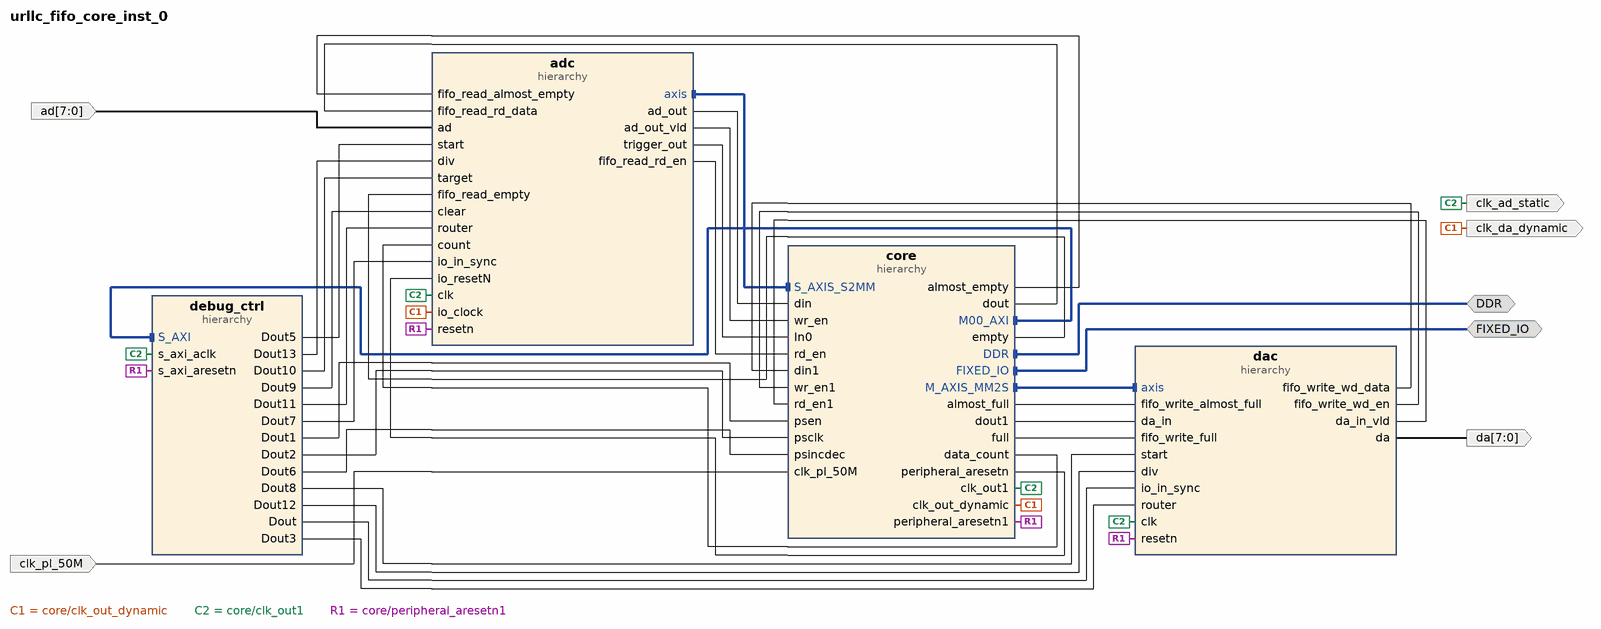
[diagram p0: block diagram of the top level]
# Vivado block design urllc_fifo_core_inst_0, xc7z020clg400-2, Vivado 2021.1
create_bd_design urllc_fifo_core_inst_0

create_bd_intf_port -mode Master -vlnv xilinx.com:interface:ddrx_rtl:1.0 DDR
create_bd_intf_port -mode Master -vlnv xilinx.com:display_processing_system7:fixedio_rtl:1.0 FIXED_IO
create_bd_port -dir I -from 7 -to 0 ad
create_bd_port -dir O -type clk clk_ad_static
create_bd_port -dir O -from 7 -to 0 da
create_bd_port -dir O -type clk clk_da_dynamic
create_bd_port -dir I -type clk clk_pl_50M

create_bd_cell -type hier adc
create_bd_cell -type hier core
create_bd_cell -type hier dac
create_bd_cell -type hier debug_ctrl

# ---- hierarchy /adc ----
current_bd_instance /adc
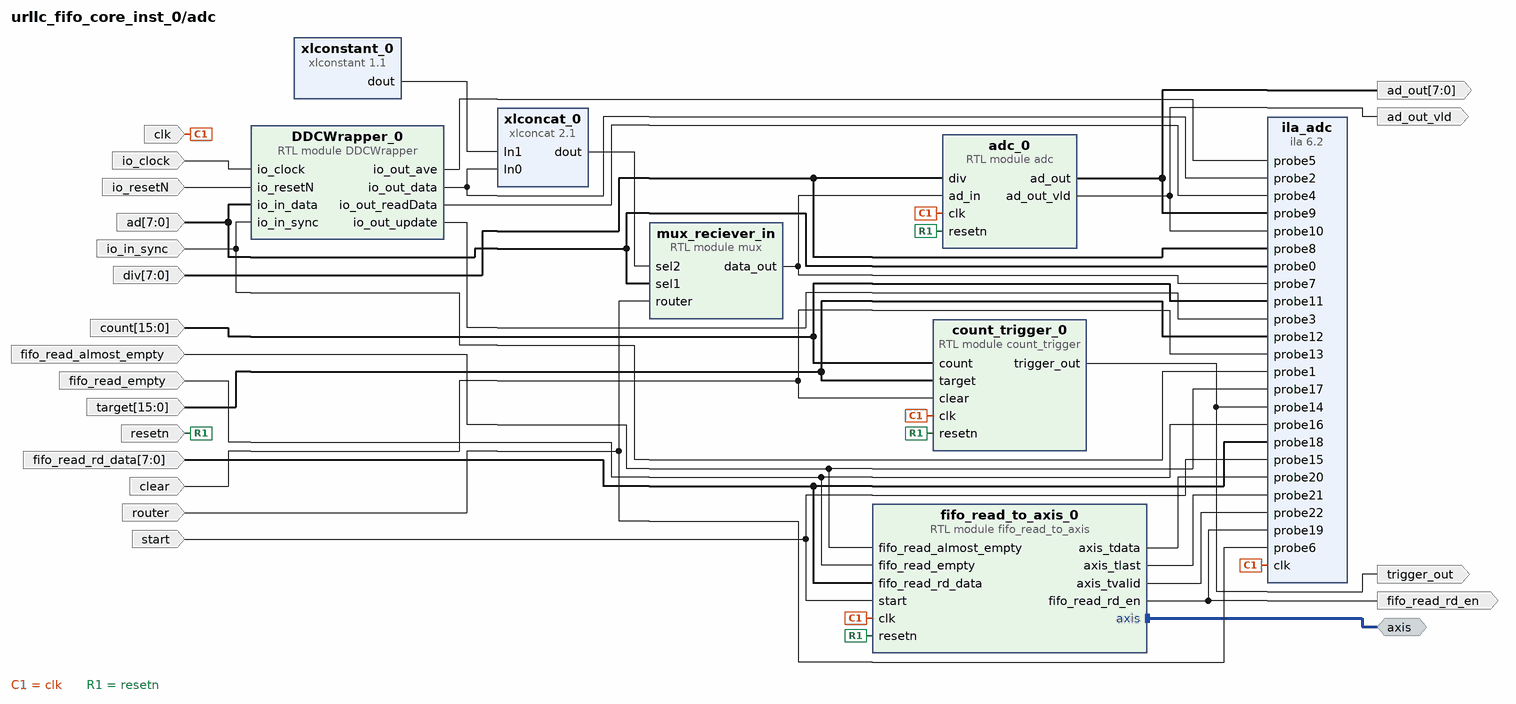
[diagram p1: block diagram inside /adc]
create_bd_intf_pin -mode Master -vlnv xilinx.com:interface:axis_rtl:1.0 axis
create_bd_pin -dir I -from 7 -to 0 ad
create_bd_pin -dir I io_in_sync
create_bd_pin -dir I -type clk clk
create_bd_pin -dir I -type rst resetn
create_bd_pin -dir O -from 7 -to 0 ad_out
create_bd_pin -dir O ad_out_vld
create_bd_pin -dir I router
create_bd_pin -dir I -from 15 -to 0 count
create_bd_pin -dir I -from 15 -to 0 target
create_bd_pin -dir I clear
create_bd_pin -dir O trigger_out
create_bd_pin -dir I fifo_read_almost_empty
create_bd_pin -dir I fifo_read_empty
create_bd_pin -dir O fifo_read_rd_en
create_bd_pin -dir I -from 7 -to 0 fifo_read_rd_data
create_bd_pin -dir I start
create_bd_pin -dir I -type clk io_clock
create_bd_pin -dir I -type rst io_resetN
create_bd_pin -dir I -from 7 -to 0 div

create_bd_cell -type module -reference DDCWrapper DDCWrapper_0
create_bd_cell -type module -reference mux mux_reciever_in
create_bd_cell -type module -reference count_trigger count_trigger_0
create_bd_cell -type module -reference fifo_read_to_axis fifo_read_to_axis_0
create_bd_cell -type module -reference adc adc_0
create_bd_cell -type ip -vlnv xilinx.com:ip:xlconcat:2.1 xlconcat_0
set_property -dict {CONFIG.dout_width 8} [get_bd_cells xlconcat_0]
create_bd_cell -type ip -vlnv xilinx.com:ip:xlconstant:1.1 xlconstant_0
set_property -dict {CONFIG.CONST_VAL 0 CONFIG.CONST_WIDTH 7} [get_bd_cells xlconstant_0]
create_bd_cell -type ip -vlnv xilinx.com:ip:ila:6.2 ila_adc
set_property -dict [list \
  CONFIG.C_DATA_DEPTH 8192 \
  CONFIG.C_ENABLE_ILA_AXI_MON false \
  CONFIG.C_MONITOR_TYPE Native \
  CONFIG.C_NUM_OF_PROBES 23 \
] [get_bd_cells ila_adc]

# ---- hierarchy /core ----
current_bd_instance /core
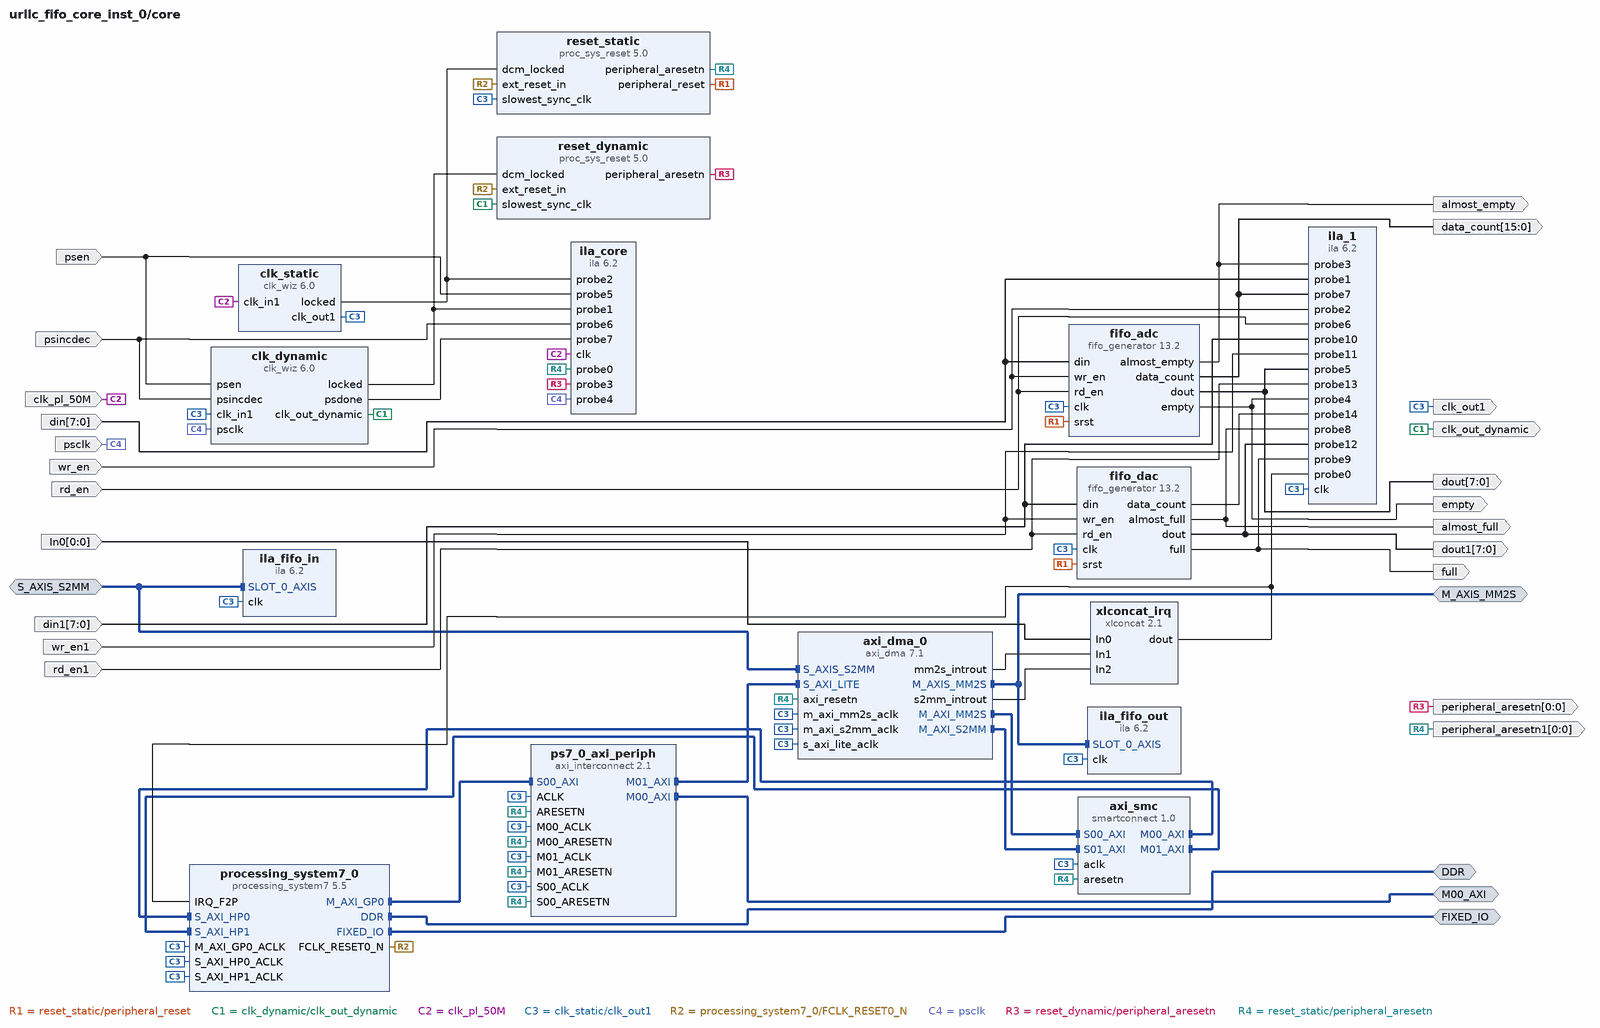
[diagram p2: block diagram inside /core]
create_bd_intf_pin -mode Master -vlnv xilinx.com:interface:ddrx_rtl:1.0 DDR
create_bd_intf_pin -mode Master -vlnv xilinx.com:display_processing_system7:fixedio_rtl:1.0 FIXED_IO
create_bd_intf_pin -mode Master -vlnv xilinx.com:interface:axis_rtl:1.0 M_AXIS_MM2S
create_bd_intf_pin -mode Slave -vlnv xilinx.com:interface:axis_rtl:1.0 S_AXIS_S2MM
create_bd_intf_pin -mode Master -vlnv xilinx.com:interface:aximm_rtl:1.0 M00_AXI
create_bd_pin -dir O -from 0 -to 0 -type rst peripheral_aresetn
create_bd_pin -dir I -from 7 -to 0 din
create_bd_pin -dir I wr_en
create_bd_pin -dir I rd_en
create_bd_pin -dir O -from 7 -to 0 dout
create_bd_pin -dir O empty
create_bd_pin -dir O almost_empty
create_bd_pin -dir O -from 15 -to 0 data_count
create_bd_pin -dir I -from 7 -to 0 din1
create_bd_pin -dir I wr_en1
create_bd_pin -dir I rd_en1
create_bd_pin -dir O -from 7 -to 0 dout1
create_bd_pin -dir O full
create_bd_pin -dir O almost_full
create_bd_pin -dir O -type clk clk_out_dynamic
create_bd_pin -dir O -type clk clk_out1
create_bd_pin -dir I psincdec
create_bd_pin -dir I psen
create_bd_pin -dir I psclk
create_bd_pin -dir O -from 0 -to 0 -type rst peripheral_aresetn1
create_bd_pin -dir I -from 0 -to 0 In0
create_bd_pin -dir I clk_pl_50M

create_bd_cell -type ip -vlnv xilinx.com:ip:processing_system7:5.5 processing_system7_0
set_property -dict [list \
  CONFIG.PCW_APU_PERIPHERAL_FREQMHZ 666.666666 \
  CONFIG.PCW_CPU_CPU_6X4X_MAX_RANGE 767 \
  CONFIG.PCW_ENET0_ENET0_IO {MIO 16 .. 27} \
  CONFIG.PCW_ENET0_GRP_MDIO_ENABLE 1 \
  CONFIG.PCW_ENET0_GRP_MDIO_IO EMIO \
  CONFIG.PCW_ENET0_PERIPHERAL_ENABLE 1 \
  CONFIG.PCW_FPGA0_PERIPHERAL_FREQMHZ 50 \
  CONFIG.PCW_FPGA1_PERIPHERAL_FREQMHZ 50 \
  CONFIG.PCW_GPIO_MIO_GPIO_ENABLE 0 \
  CONFIG.PCW_IRQ_F2P_INTR 1 \
  CONFIG.PCW_PERIPHERAL_BOARD_PRESET None \
  CONFIG.PCW_PRESET_BANK1_VOLTAGE {LVCMOS 1.8V} \
  CONFIG.PCW_QSPI_GRP_SINGLE_SS_ENABLE 1 \
  CONFIG.PCW_QSPI_GRP_SINGLE_SS_IO {MIO 1 .. 6} \
  CONFIG.PCW_QSPI_PERIPHERAL_ENABLE 1 \
  CONFIG.PCW_QSPI_QSPI_IO {MIO 1 .. 6} \
  CONFIG.PCW_SD0_GRP_CD_ENABLE 0 \
  CONFIG.PCW_SD0_GRP_WP_ENABLE 0 \
  CONFIG.PCW_SD0_PERIPHERAL_ENABLE 1 \
  CONFIG.PCW_SD0_SD0_IO {MIO 40 .. 45} \
  CONFIG.PCW_SDIO_PERIPHERAL_FREQMHZ 100 \
  CONFIG.PCW_SINGLE_QSPI_DATA_MODE x4 \
  CONFIG.PCW_UART1_PERIPHERAL_ENABLE 1 \
  CONFIG.PCW_UART1_UART1_IO {MIO 48 .. 49} \
  CONFIG.PCW_UART_PERIPHERAL_FREQMHZ 100 \
  CONFIG.PCW_UIPARAM_DDR_BUS_WIDTH {16 Bit} \
  CONFIG.PCW_UIPARAM_DDR_FREQ_MHZ 533.333333 \
  CONFIG.PCW_UIPARAM_DDR_PARTNO {MT41J256M16 RE-125} \
  CONFIG.PCW_USB0_PERIPHERAL_ENABLE 0 \
  CONFIG.PCW_USE_FABRIC_INTERRUPT 1 \
  CONFIG.PCW_USE_S_AXI_HP0 1 \
  CONFIG.PCW_USE_S_AXI_HP1 1 \
] [get_bd_cells processing_system7_0]
# 423 more settings of processing_system7_0 are not shown: defaults, MIO pin electricals, DDR timing, and values the tool derives
create_bd_cell -type ip -vlnv xilinx.com:ip:proc_sys_reset:5.0 reset_dynamic
create_bd_cell -type ip -vlnv xilinx.com:ip:axi_dma:7.1 axi_dma_0
set_property -dict [list \
  CONFIG.c_include_sg 0 \
  CONFIG.c_m_axis_mm2s_tdata_width 8 \
  CONFIG.c_mm2s_burst_size 256 \
  CONFIG.c_s2mm_burst_size 256 \
] [get_bd_cells axi_dma_0]
create_bd_cell -type ip -vlnv xilinx.com:ip:smartconnect:1.0 axi_smc
set_property -dict {CONFIG.NUM_MI 2 CONFIG.NUM_SI 2} [get_bd_cells axi_smc]
create_bd_cell -type ip -vlnv xilinx.com:ip:clk_wiz:6.0 clk_dynamic
set_property -dict [list \
  CONFIG.CLKIN1_JITTER_PS 166.66 \
  CONFIG.CLKOUT1_JITTER 163.829 \
  CONFIG.CLKOUT1_PHASE_ERROR 130.371 \
  CONFIG.CLKOUT1_REQUESTED_OUT_FREQ 60 \
  CONFIG.CLK_OUT1_PORT clk_out_dynamic \
  CONFIG.MMCM_CLKFBOUT_MULT_F 17.000 \
  CONFIG.MMCM_CLKIN1_PERIOD 16.667 \
  CONFIG.MMCM_CLKIN2_PERIOD 10.0 \
  CONFIG.MMCM_CLKOUT0_DIVIDE_F 17.000 \
  CONFIG.MMCM_DIVCLK_DIVIDE 1 \
  CONFIG.PRIM_IN_FREQ 60.000 \
  CONFIG.PRIM_SOURCE Global_buffer \
  CONFIG.RESET_PORT reset \
  CONFIG.RESET_TYPE ACTIVE_HIGH \
  CONFIG.USE_DYN_PHASE_SHIFT true \
  CONFIG.USE_RESET false \
] [get_bd_cells clk_dynamic]
create_bd_cell -type ip -vlnv xilinx.com:ip:fifo_generator:13.2 fifo_adc
set_property -dict [list \
  CONFIG.Almost_Empty_Flag true \
  CONFIG.Almost_Full_Flag true \
  CONFIG.Data_Count true \
  CONFIG.Data_Count_Width 16 \
  CONFIG.FIFO_Implementation_rach Common_Clock_Distributed_RAM \
  CONFIG.FIFO_Implementation_wach Common_Clock_Distributed_RAM \
  CONFIG.FIFO_Implementation_wrch Common_Clock_Distributed_RAM \
  CONFIG.INTERFACE_TYPE Native \
  CONFIG.Input_Data_Width 8 \
  CONFIG.Input_Depth 65536 \
  CONFIG.Output_Data_Width 8 \
  CONFIG.Reset_Type Synchronous_Reset \
] [get_bd_cells fifo_adc]
create_bd_cell -type ip -vlnv xilinx.com:ip:fifo_generator:13.2 fifo_dac
set_property -dict [list \
  CONFIG.Almost_Empty_Flag true \
  CONFIG.Almost_Full_Flag true \
  CONFIG.Data_Count true \
  CONFIG.Data_Count_Width 16 \
  CONFIG.Input_Data_Width 8 \
  CONFIG.Input_Depth 65536 \
  CONFIG.Output_Data_Width 8 \
] [get_bd_cells fifo_dac]
create_bd_cell -type ip -vlnv xilinx.com:ip:axi_interconnect:2.1 ps7_0_axi_periph
set_property -dict {CONFIG.NUM_MI 2} [get_bd_cells ps7_0_axi_periph]
create_bd_cell -type ip -vlnv xilinx.com:ip:xlconcat:2.1 xlconcat_irq
set_property -dict {CONFIG.NUM_PORTS 3 CONFIG.dout_width 3} [get_bd_cells xlconcat_irq]
create_bd_cell -type ip -vlnv xilinx.com:ip:proc_sys_reset:5.0 reset_static
create_bd_cell -type ip -vlnv xilinx.com:ip:ila:6.2 ila_core
set_property -dict [list \
  CONFIG.C_DATA_DEPTH 8192 \
  CONFIG.C_ENABLE_ILA_AXI_MON false \
  CONFIG.C_MONITOR_TYPE Native \
  CONFIG.C_NUM_OF_PROBES 8 \
] [get_bd_cells ila_core]
create_bd_cell -type ip -vlnv xilinx.com:ip:clk_wiz:6.0 clk_static
set_property -dict [list \
  CONFIG.CLKIN1_JITTER_PS 200.0 \
  CONFIG.CLKOUT1_JITTER 180.523 \
  CONFIG.CLKOUT1_PHASE_ERROR 162.874 \
  CONFIG.CLKOUT1_REQUESTED_OUT_FREQ 60.000 \
  CONFIG.MMCM_CLKFBOUT_MULT_F 20.250 \
  CONFIG.MMCM_CLKIN1_PERIOD 20.000 \
  CONFIG.MMCM_CLKIN2_PERIOD 10.0 \
  CONFIG.MMCM_CLKOUT0_DIVIDE_F 16.875 \
  CONFIG.MMCM_DIVCLK_DIVIDE 1 \
  CONFIG.PRIM_SOURCE Single_ended_clock_capable_pin \
  CONFIG.RESET_PORT reset \
  CONFIG.RESET_TYPE ACTIVE_HIGH \
  CONFIG.USE_RESET false \
] [get_bd_cells clk_static]
create_bd_cell -type ip -vlnv xilinx.com:ip:ila:6.2 ila_1
set_property -dict [list \
  CONFIG.C_DATA_DEPTH 8192 \
  CONFIG.C_ENABLE_ILA_AXI_MON false \
  CONFIG.C_MONITOR_TYPE Native \
  CONFIG.C_NUM_OF_PROBES 15 \
  CONFIG.C_PROBE0_WIDTH 3 \
] [get_bd_cells ila_1]
create_bd_cell -type ip -vlnv xilinx.com:ip:ila:6.2 ila_fifo_in
set_property -dict [list \
  CONFIG.C_ENABLE_ILA_AXI_MON true \
  CONFIG.C_MONITOR_TYPE AXI \
  CONFIG.C_NUM_OF_PROBES 9 \
  CONFIG.C_SLOT_0_AXI_PROTOCOL AXI4S \
] [get_bd_cells ila_fifo_in]
create_bd_cell -type ip -vlnv xilinx.com:ip:ila:6.2 ila_fifo_out
set_property -dict [list \
  CONFIG.C_ENABLE_ILA_AXI_MON true \
  CONFIG.C_MONITOR_TYPE AXI \
  CONFIG.C_NUM_OF_PROBES 9 \
  CONFIG.C_SLOT_0_AXI_PROTOCOL AXI4S \
] [get_bd_cells ila_fifo_out]

# ---- hierarchy /dac ----
current_bd_instance /dac
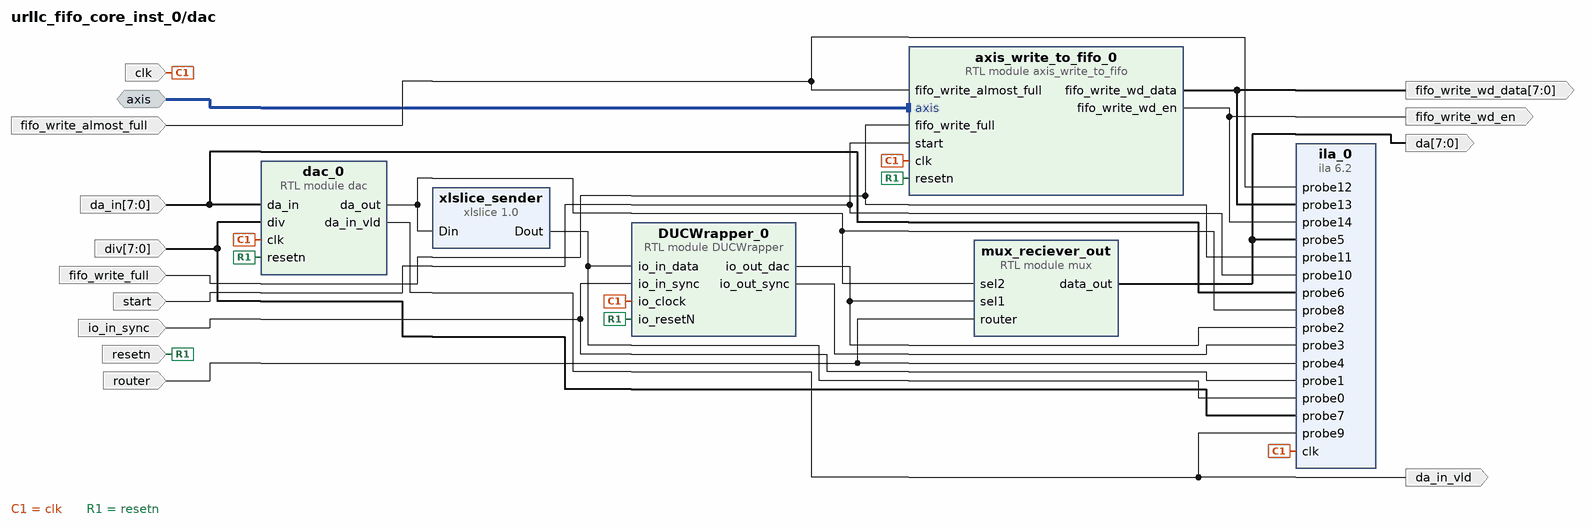
[diagram p3: block diagram inside /dac]
create_bd_intf_pin -mode Slave -vlnv xilinx.com:interface:axis_rtl:1.0 axis
create_bd_pin -dir O -from 7 -to 0 da
create_bd_pin -dir I router
create_bd_pin -dir I io_in_sync
create_bd_pin -dir I -type clk clk
create_bd_pin -dir I -type rst resetn
create_bd_pin -dir I start
create_bd_pin -dir I fifo_write_full
create_bd_pin -dir I fifo_write_almost_full
create_bd_pin -dir O -from 7 -to 0 fifo_write_wd_data
create_bd_pin -dir O fifo_write_wd_en
create_bd_pin -dir I -from 7 -to 0 da_in
create_bd_pin -dir I -from 7 -to 0 div
create_bd_pin -dir O da_in_vld

create_bd_cell -type module -reference mux mux_reciever_out
create_bd_cell -type module -reference axis_write_to_fifo axis_write_to_fifo_0
create_bd_cell -type module -reference dac dac_0
create_bd_cell -type module -reference DUCWrapper DUCWrapper_0
create_bd_cell -type ip -vlnv xilinx.com:ip:xlslice:1.0 xlslice_sender
set_property -dict {CONFIG.DIN_FROM 0 CONFIG.DIN_TO 0 CONFIG.DIN_WIDTH 8} [get_bd_cells xlslice_sender]
create_bd_cell -type ip -vlnv xilinx.com:ip:ila:6.2 ila_0
set_property -dict [list \
  CONFIG.C_DATA_DEPTH 8192 \
  CONFIG.C_ENABLE_ILA_AXI_MON false \
  CONFIG.C_MONITOR_TYPE Native \
  CONFIG.C_NUM_OF_PROBES 15 \
] [get_bd_cells ila_0]

# ---- hierarchy /debug_ctrl ----
current_bd_instance /debug_ctrl
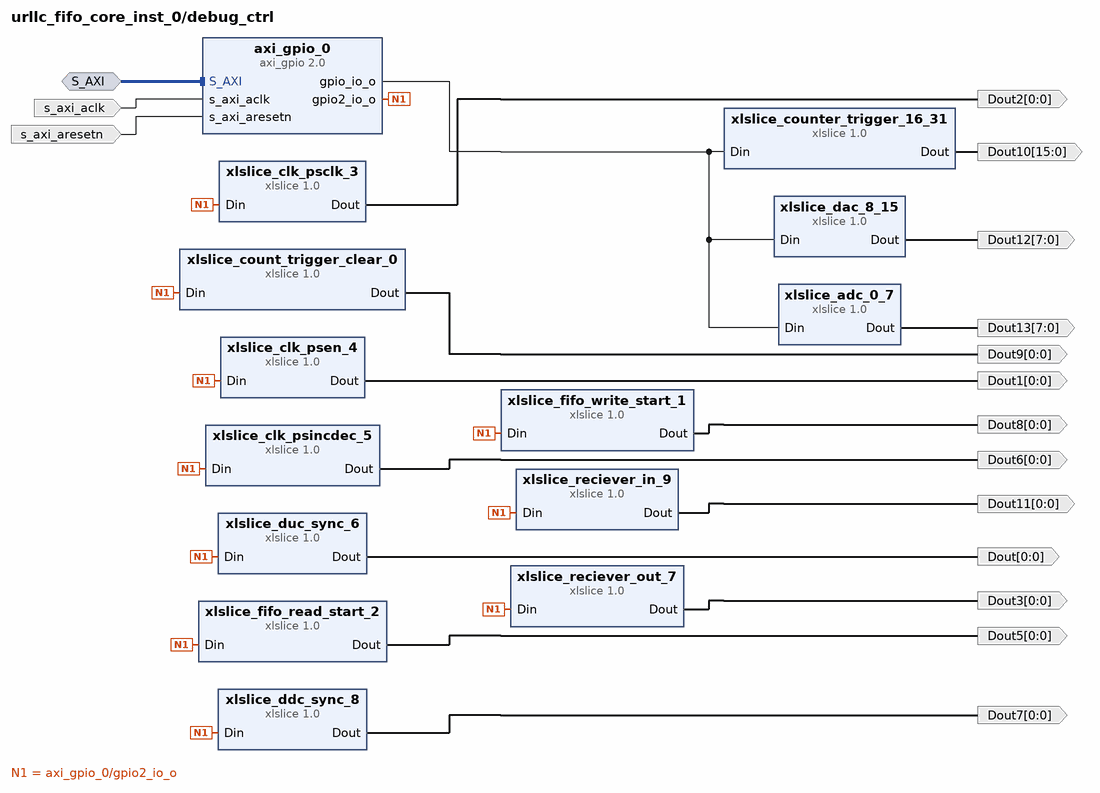
[diagram p4: block diagram inside /debug_ctrl]
create_bd_intf_pin -mode Slave -vlnv xilinx.com:interface:aximm_rtl:1.0 S_AXI
create_bd_pin -dir O -from 0 -to 0 Dout
create_bd_pin -dir O -from 0 -to 0 Dout1
create_bd_pin -dir O -from 0 -to 0 Dout2
create_bd_pin -dir O -from 0 -to 0 Dout3
create_bd_pin -dir O -from 0 -to 0 Dout5
create_bd_pin -dir I -type clk s_axi_aclk
create_bd_pin -dir I -type rst s_axi_aresetn
create_bd_pin -dir O -from 0 -to 0 Dout6
create_bd_pin -dir O -from 0 -to 0 Dout7
create_bd_pin -dir O -from 0 -to 0 Dout8
create_bd_pin -dir O -from 0 -to 0 Dout9
create_bd_pin -dir O -from 15 -to 0 Dout10
create_bd_pin -dir O -from 0 -to 0 Dout11
create_bd_pin -dir O -from 7 -to 0 Dout12
create_bd_pin -dir O -from 7 -to 0 Dout13

create_bd_cell -type ip -vlnv xilinx.com:ip:axi_gpio:2.0 axi_gpio_0
set_property -dict {CONFIG.C_ALL_OUTPUTS 1 CONFIG.C_ALL_OUTPUTS_2 1 CONFIG.C_IS_DUAL 1} [get_bd_cells axi_gpio_0]
create_bd_cell -type ip -vlnv xilinx.com:ip:xlslice:1.0 xlslice_fifo_write_start_1
set_property -dict {CONFIG.DIN_FROM 1 CONFIG.DIN_TO 1 CONFIG.DOUT_WIDTH 1} [get_bd_cells xlslice_fifo_write_start_1]
create_bd_cell -type ip -vlnv xilinx.com:ip:xlslice:1.0 xlslice_counter_trigger_16_31
set_property -dict {CONFIG.DIN_FROM 31 CONFIG.DIN_TO 16 CONFIG.DOUT_WIDTH 16} [get_bd_cells xlslice_counter_trigger_16_31]
create_bd_cell -type ip -vlnv xilinx.com:ip:xlslice:1.0 xlslice_count_trigger_clear_0
set_property -dict {CONFIG.DIN_FROM 0 CONFIG.DIN_TO 0 CONFIG.DOUT_WIDTH 1} [get_bd_cells xlslice_count_trigger_clear_0]
create_bd_cell -type ip -vlnv xilinx.com:ip:xlslice:1.0 xlslice_dac_8_15
set_property -dict {CONFIG.DIN_FROM 15 CONFIG.DIN_TO 8 CONFIG.DOUT_WIDTH 8} [get_bd_cells xlslice_dac_8_15]
create_bd_cell -type ip -vlnv xilinx.com:ip:xlslice:1.0 xlslice_clk_psen_4
set_property -dict {CONFIG.DIN_FROM 4 CONFIG.DIN_TO 4 CONFIG.DOUT_WIDTH 1} [get_bd_cells xlslice_clk_psen_4]
create_bd_cell -type ip -vlnv xilinx.com:ip:xlslice:1.0 xlslice_clk_psincdec_5
set_property -dict {CONFIG.DIN_FROM 5 CONFIG.DIN_TO 5 CONFIG.DOUT_WIDTH 1} [get_bd_cells xlslice_clk_psincdec_5]
create_bd_cell -type ip -vlnv xilinx.com:ip:xlslice:1.0 xlslice_clk_psclk_3
set_property -dict {CONFIG.DIN_FROM 3 CONFIG.DIN_TO 3 CONFIG.DOUT_WIDTH 1} [get_bd_cells xlslice_clk_psclk_3]
create_bd_cell -type ip -vlnv xilinx.com:ip:xlslice:1.0 xlslice_duc_sync_6
set_property -dict {CONFIG.DIN_FROM 6 CONFIG.DIN_TO 6 CONFIG.DOUT_WIDTH 1} [get_bd_cells xlslice_duc_sync_6]
create_bd_cell -type ip -vlnv xilinx.com:ip:xlslice:1.0 xlslice_reciever_in_9
set_property -dict {CONFIG.DIN_FROM 9 CONFIG.DIN_TO 9 CONFIG.DOUT_WIDTH 1} [get_bd_cells xlslice_reciever_in_9]
create_bd_cell -type ip -vlnv xilinx.com:ip:xlslice:1.0 xlslice_reciever_out_7
set_property -dict {CONFIG.DIN_FROM 7 CONFIG.DIN_TO 7 CONFIG.DOUT_WIDTH 1} [get_bd_cells xlslice_reciever_out_7]
create_bd_cell -type ip -vlnv xilinx.com:ip:xlslice:1.0 xlslice_fifo_read_start_2
set_property -dict {CONFIG.DIN_FROM 1 CONFIG.DIN_TO 1 CONFIG.DOUT_WIDTH 1} [get_bd_cells xlslice_fifo_read_start_2]
create_bd_cell -type ip -vlnv xilinx.com:ip:xlslice:1.0 xlslice_ddc_sync_8
set_property -dict {CONFIG.DIN_FROM 8 CONFIG.DIN_TO 8 CONFIG.DOUT_WIDTH 1} [get_bd_cells xlslice_ddc_sync_8]
create_bd_cell -type ip -vlnv xilinx.com:ip:xlslice:1.0 xlslice_adc_0_7
set_property -dict {CONFIG.DIN_FROM 7 CONFIG.DOUT_WIDTH 8} [get_bd_cells xlslice_adc_0_7]

# ---- connections ----

current_bd_instance /adc
connect_bd_intf_net [get_bd_intf_pins axis] [get_bd_intf_pins fifo_read_to_axis_0/axis]
connect_bd_net [get_bd_pins DDCWrapper_0/io_out_ave] [get_bd_pins ila_adc/probe5]
connect_bd_net [get_bd_pins DDCWrapper_0/io_out_data] [get_bd_pins xlconcat_0/In0] [get_bd_pins ila_adc/probe2]
connect_bd_net [get_bd_pins DDCWrapper_0/io_out_readData] [get_bd_pins ila_adc/probe4]
connect_bd_net [get_bd_pins DDCWrapper_0/io_out_update] [get_bd_pins ila_adc/probe3]
connect_bd_net [get_bd_pins clk] \
  [get_bd_pins fifo_read_to_axis_0/clk] [get_bd_pins count_trigger_0/clk] [get_bd_pins adc_0/clk] [get_bd_pins ila_adc/clk]
connect_bd_net [get_bd_pins resetn] [get_bd_pins fifo_read_to_axis_0/resetn] [get_bd_pins count_trigger_0/resetn] [get_bd_pins adc_0/resetn]
connect_bd_net [get_bd_pins io_clock] [get_bd_pins DDCWrapper_0/io_clock]
connect_bd_net [get_bd_pins io_resetN] [get_bd_pins DDCWrapper_0/io_resetN]
connect_bd_net [get_bd_pins ad] [get_bd_pins mux_reciever_in/sel1] [get_bd_pins DDCWrapper_0/io_in_data] [get_bd_pins ila_adc/probe0]
connect_bd_net [get_bd_pins adc_0/ad_out] [get_bd_pins ad_out] [get_bd_pins ila_adc/probe9]
connect_bd_net [get_bd_pins adc_0/ad_out_vld] [get_bd_pins ad_out_vld] [get_bd_pins ila_adc/probe10]
connect_bd_net [get_bd_pins count_trigger_0/trigger_out] [get_bd_pins trigger_out] [get_bd_pins ila_adc/probe14]
connect_bd_net [get_bd_pins div] [get_bd_pins adc_0/div] [get_bd_pins ila_adc/probe8]
connect_bd_net -net fifo_adc_data_count [get_bd_pins count] [get_bd_pins count_trigger_0/count] [get_bd_pins ila_adc/probe11]
connect_bd_net [get_bd_pins fifo_read_almost_empty] [get_bd_pins fifo_read_to_axis_0/fifo_read_almost_empty] [get_bd_pins ila_adc/probe17]
connect_bd_net [get_bd_pins fifo_read_empty] [get_bd_pins fifo_read_to_axis_0/fifo_read_empty] [get_bd_pins ila_adc/probe16]
connect_bd_net [get_bd_pins fifo_read_rd_data] [get_bd_pins fifo_read_to_axis_0/fifo_read_rd_data] [get_bd_pins ila_adc/probe18]
connect_bd_net [get_bd_pins fifo_read_to_axis_0/axis_tdata] [get_bd_pins ila_adc/probe20]
connect_bd_net [get_bd_pins fifo_read_to_axis_0/axis_tlast] [get_bd_pins ila_adc/probe21]
connect_bd_net [get_bd_pins fifo_read_to_axis_0/axis_tvalid] [get_bd_pins ila_adc/probe22]
connect_bd_net [get_bd_pins fifo_read_to_axis_0/fifo_read_rd_en] [get_bd_pins fifo_read_rd_en] [get_bd_pins ila_adc/probe19]
connect_bd_net [get_bd_pins io_in_sync] [get_bd_pins DDCWrapper_0/io_in_sync] [get_bd_pins ila_adc/probe1]
connect_bd_net [get_bd_pins mux_reciever_in/data_out] [get_bd_pins adc_0/ad_in] [get_bd_pins ila_adc/probe7]
connect_bd_net [get_bd_pins start] [get_bd_pins fifo_read_to_axis_0/start] [get_bd_pins ila_adc/probe15]
connect_bd_net [get_bd_pins xlconcat_0/dout] [get_bd_pins mux_reciever_in/sel2]
connect_bd_net [get_bd_pins xlconstant_0/dout] [get_bd_pins xlconcat_0/In1]
connect_bd_net -net xlslice_1_Dout [get_bd_pins target] [get_bd_pins count_trigger_0/target] [get_bd_pins ila_adc/probe12]
connect_bd_net -net xlslice_2_Dout [get_bd_pins clear] [get_bd_pins count_trigger_0/clear] [get_bd_pins ila_adc/probe13]
connect_bd_net -net xlslice_reciever_in_10_Dout [get_bd_pins router] [get_bd_pins mux_reciever_in/router] [get_bd_pins ila_adc/probe6]

current_bd_instance /core
connect_bd_intf_net [get_bd_intf_pins M_AXIS_MM2S] [get_bd_intf_pins axi_dma_0/M_AXIS_MM2S]
connect_bd_intf_net [get_bd_intf_pins M_AXIS_MM2S] [get_bd_intf_pins ila_fifo_out/SLOT_0_AXIS]
connect_bd_intf_net [get_bd_intf_pins axi_dma_0/M_AXI_MM2S] [get_bd_intf_pins axi_smc/S00_AXI]
connect_bd_intf_net [get_bd_intf_pins axi_dma_0/M_AXI_S2MM] [get_bd_intf_pins axi_smc/S01_AXI]
connect_bd_intf_net [get_bd_intf_pins axi_smc/M00_AXI] [get_bd_intf_pins processing_system7_0/S_AXI_HP0]
connect_bd_intf_net [get_bd_intf_pins axi_smc/M01_AXI] [get_bd_intf_pins processing_system7_0/S_AXI_HP1]
connect_bd_intf_net [get_bd_intf_pins S_AXIS_S2MM] [get_bd_intf_pins axi_dma_0/S_AXIS_S2MM]
connect_bd_intf_net [get_bd_intf_pins S_AXIS_S2MM] [get_bd_intf_pins ila_fifo_in/SLOT_0_AXIS]
connect_bd_intf_net [get_bd_intf_pins DDR] [get_bd_intf_pins processing_system7_0/DDR]
connect_bd_intf_net [get_bd_intf_pins FIXED_IO] [get_bd_intf_pins processing_system7_0/FIXED_IO]
connect_bd_intf_net [get_bd_intf_pins processing_system7_0/M_AXI_GP0] [get_bd_intf_pins ps7_0_axi_periph/S00_AXI]
connect_bd_intf_net [get_bd_intf_pins M00_AXI] [get_bd_intf_pins ps7_0_axi_periph/M00_AXI]
connect_bd_intf_net [get_bd_intf_pins ps7_0_axi_periph/M01_AXI] [get_bd_intf_pins axi_dma_0/S_AXI_LITE]
connect_bd_net -net In0_1 [get_bd_pins In0] [get_bd_pins xlconcat_irq/In0]
connect_bd_net [get_bd_pins reset_static/peripheral_reset] [get_bd_pins fifo_adc/srst] [get_bd_pins fifo_dac/srst]
connect_bd_net -net adc_0_ad_out [get_bd_pins din] [get_bd_pins fifo_adc/din] [get_bd_pins ila_1/probe1]
connect_bd_net -net adc_0_ad_out_vld [get_bd_pins wr_en] [get_bd_pins fifo_adc/wr_en] [get_bd_pins ila_1/probe2]
connect_bd_net [get_bd_pins axi_dma_0/mm2s_introut] [get_bd_pins xlconcat_irq/In1]
connect_bd_net [get_bd_pins axi_dma_0/s2mm_introut] [get_bd_pins xlconcat_irq/In2]
connect_bd_net -net axis_write_to_fifo_0_fifo_write_wd_data [get_bd_pins din1] [get_bd_pins fifo_dac/din] [get_bd_pins ila_1/probe10]
connect_bd_net -net axis_write_to_fifo_0_fifo_write_wd_en [get_bd_pins wr_en1] [get_bd_pins fifo_dac/wr_en] [get_bd_pins ila_1/probe11]
connect_bd_net -net clk_dynamic_clk_out_200M [get_bd_pins clk_dynamic/clk_out_dynamic] \
  [get_bd_pins reset_dynamic/slowest_sync_clk] [get_bd_pins clk_out_dynamic]
connect_bd_net [get_bd_pins clk_dynamic/locked] [get_bd_pins reset_dynamic/dcm_locked] [get_bd_pins ila_core/probe1]
connect_bd_net [get_bd_pins clk_dynamic/psdone] [get_bd_pins ila_core/probe7]
connect_bd_net [get_bd_pins clk_pl_50M] [get_bd_pins ila_core/clk] [get_bd_pins clk_static/clk_in1]
connect_bd_net [get_bd_pins clk_static/clk_out1] \
  [get_bd_pins clk_out1] [get_bd_pins processing_system7_0/S_AXI_HP0_ACLK] [get_bd_pins processing_system7_0/S_AXI_HP1_ACLK] \
  [get_bd_pins processing_system7_0/M_AXI_GP0_ACLK] [get_bd_pins axi_dma_0/s_axi_lite_aclk] \
  [get_bd_pins axi_dma_0/m_axi_mm2s_aclk] [get_bd_pins axi_dma_0/m_axi_s2mm_aclk] [get_bd_pins axi_smc/aclk] \
  [get_bd_pins fifo_adc/clk] [get_bd_pins fifo_dac/clk] [get_bd_pins ps7_0_axi_periph/ACLK] \
  [get_bd_pins ps7_0_axi_periph/S00_ACLK] [get_bd_pins ps7_0_axi_periph/M00_ACLK] [get_bd_pins ps7_0_axi_periph/M01_ACLK] \
  [get_bd_pins reset_static/slowest_sync_clk] [get_bd_pins clk_dynamic/clk_in1] [get_bd_pins ila_1/clk] \
  [get_bd_pins ila_fifo_in/clk] [get_bd_pins ila_fifo_out/clk]
connect_bd_net [get_bd_pins clk_static/locked] [get_bd_pins reset_static/dcm_locked] [get_bd_pins ila_core/probe2]
connect_bd_net -net dac_0_da_in_vld [get_bd_pins rd_en1] [get_bd_pins fifo_dac/rd_en] [get_bd_pins ila_1/probe13]
connect_bd_net [get_bd_pins fifo_adc/almost_empty] [get_bd_pins almost_empty] [get_bd_pins ila_1/probe3]
connect_bd_net [get_bd_pins fifo_adc/data_count] [get_bd_pins data_count] [get_bd_pins ila_1/probe7]
connect_bd_net [get_bd_pins fifo_adc/dout] [get_bd_pins dout] [get_bd_pins ila_1/probe5]
connect_bd_net [get_bd_pins fifo_adc/empty] [get_bd_pins empty] [get_bd_pins ila_1/probe4]
connect_bd_net [get_bd_pins fifo_dac/almost_full] [get_bd_pins almost_full] [get_bd_pins ila_1/probe8]
connect_bd_net [get_bd_pins fifo_dac/data_count] [get_bd_pins ila_1/probe14]
connect_bd_net [get_bd_pins fifo_dac/dout] [get_bd_pins dout1] [get_bd_pins ila_1/probe12]
connect_bd_net [get_bd_pins fifo_dac/full] [get_bd_pins full] [get_bd_pins ila_1/probe9]
connect_bd_net -net fifo_read_to_axis_0_fifo_read_rd_en [get_bd_pins rd_en] [get_bd_pins fifo_adc/rd_en] [get_bd_pins ila_1/probe6]
connect_bd_net [get_bd_pins processing_system7_0/FCLK_RESET0_N] [get_bd_pins reset_dynamic/ext_reset_in] [get_bd_pins reset_static/ext_reset_in]
connect_bd_net [get_bd_pins psclk] [get_bd_pins clk_dynamic/psclk] [get_bd_pins ila_core/probe4]
connect_bd_net [get_bd_pins psen] [get_bd_pins clk_dynamic/psen] [get_bd_pins ila_core/probe5]
connect_bd_net [get_bd_pins psincdec] [get_bd_pins clk_dynamic/psincdec] [get_bd_pins ila_core/probe6]
connect_bd_net [get_bd_pins reset_dynamic/peripheral_aresetn] [get_bd_pins peripheral_aresetn] [get_bd_pins ila_core/probe3]
connect_bd_net -net rst_ps7_0_50M_peripheral_aresetn [get_bd_pins reset_static/peripheral_aresetn] \
  [get_bd_pins peripheral_aresetn1] [get_bd_pins axi_dma_0/axi_resetn] [get_bd_pins axi_smc/aresetn] \
  [get_bd_pins ps7_0_axi_periph/ARESETN] [get_bd_pins ps7_0_axi_periph/S00_ARESETN] \
  [get_bd_pins ps7_0_axi_periph/M00_ARESETN] [get_bd_pins ps7_0_axi_periph/M01_ARESETN] [get_bd_pins ila_core/probe0]
connect_bd_net [get_bd_pins xlconcat_irq/dout] [get_bd_pins processing_system7_0/IRQ_F2P] [get_bd_pins ila_1/probe0]

current_bd_instance /dac
connect_bd_intf_net -intf_net axi_dma_0_M_AXIS_MM2S [get_bd_intf_pins axis] [get_bd_intf_pins axis_write_to_fifo_0/axis]
connect_bd_net [get_bd_pins DUCWrapper_0/io_out_dac] [get_bd_pins mux_reciever_out/sel1] [get_bd_pins ila_0/probe2]
connect_bd_net [get_bd_pins DUCWrapper_0/io_out_sync] [get_bd_pins ila_0/probe3]
connect_bd_net [get_bd_pins dac_0/da_out] [get_bd_pins mux_reciever_out/sel2] [get_bd_pins xlslice_sender/Din] [get_bd_pins ila_0/probe8]
connect_bd_net [get_bd_pins axis_write_to_fifo_0/fifo_write_wd_data] [get_bd_pins fifo_write_wd_data] [get_bd_pins ila_0/probe13]
connect_bd_net [get_bd_pins axis_write_to_fifo_0/fifo_write_wd_en] [get_bd_pins fifo_write_wd_en] [get_bd_pins ila_0/probe14]
connect_bd_net -net clk_wiz_0_clk_out1 [get_bd_pins clk] \
  [get_bd_pins axis_write_to_fifo_0/clk] [get_bd_pins dac_0/clk] [get_bd_pins DUCWrapper_0/io_clock] [get_bd_pins ila_0/clk]
connect_bd_net [get_bd_pins dac_0/da_in_vld] [get_bd_pins da_in_vld] [get_bd_pins ila_0/probe9]
connect_bd_net -net fifo_dac_almost_full [get_bd_pins fifo_write_almost_full] \
  [get_bd_pins axis_write_to_fifo_0/fifo_write_almost_full] [get_bd_pins ila_0/probe12]
connect_bd_net -net fifo_dac_dout [get_bd_pins da_in] [get_bd_pins dac_0/da_in] [get_bd_pins ila_0/probe6]
connect_bd_net -net fifo_dac_full [get_bd_pins fifo_write_full] [get_bd_pins axis_write_to_fifo_0/fifo_write_full] [get_bd_pins ila_0/probe11]
connect_bd_net -net mux_0_data_out [get_bd_pins mux_reciever_out/data_out] [get_bd_pins da] [get_bd_pins ila_0/probe5]
connect_bd_net -net rst_ps7_0_50M_peripheral_aresetn [get_bd_pins resetn] \
  [get_bd_pins axis_write_to_fifo_0/resetn] [get_bd_pins dac_0/resetn] [get_bd_pins DUCWrapper_0/io_resetN]
connect_bd_net -net xlslice_0_Dout1 [get_bd_pins start] [get_bd_pins axis_write_to_fifo_0/start] [get_bd_pins ila_0/probe10]
connect_bd_net -net xlslice_dac_8_15_Dout [get_bd_pins div] [get_bd_pins dac_0/div] [get_bd_pins ila_0/probe7]
connect_bd_net -net xlslice_duc_sync_6_Dout [get_bd_pins io_in_sync] [get_bd_pins DUCWrapper_0/io_in_sync] [get_bd_pins ila_0/probe1]
connect_bd_net -net xlslice_reciever_out_7_Dout [get_bd_pins router] [get_bd_pins mux_reciever_out/router] [get_bd_pins ila_0/probe4]
connect_bd_net [get_bd_pins xlslice_sender/Dout] [get_bd_pins DUCWrapper_0/io_in_data] [get_bd_pins ila_0/probe0]

current_bd_instance /debug_ctrl
connect_bd_intf_net [get_bd_intf_pins S_AXI] [get_bd_intf_pins axi_gpio_0/S_AXI]
connect_bd_net [get_bd_pins axi_gpio_0/gpio2_io_o] \
  [get_bd_pins xlslice_fifo_write_start_1/Din] [get_bd_pins xlslice_count_trigger_clear_0/Din] \
  [get_bd_pins xlslice_clk_psen_4/Din] [get_bd_pins xlslice_clk_psincdec_5/Din] [get_bd_pins xlslice_clk_psclk_3/Din] \
  [get_bd_pins xlslice_duc_sync_6/Din] [get_bd_pins xlslice_reciever_in_9/Din] [get_bd_pins xlslice_reciever_out_7/Din] \
  [get_bd_pins xlslice_fifo_read_start_2/Din] [get_bd_pins xlslice_ddc_sync_8/Din]
connect_bd_net [get_bd_pins axi_gpio_0/gpio_io_o] \
  [get_bd_pins xlslice_counter_trigger_16_31/Din] [get_bd_pins xlslice_dac_8_15/Din] [get_bd_pins xlslice_adc_0_7/Din]
connect_bd_net -net clk_wiz_0_clk_out1 [get_bd_pins s_axi_aclk] [get_bd_pins axi_gpio_0/s_axi_aclk]
connect_bd_net -net rst_ps7_0_50M_peripheral_aresetn [get_bd_pins s_axi_aresetn] [get_bd_pins axi_gpio_0/s_axi_aresetn]
connect_bd_net -net xlslice_0_Dout1 [get_bd_pins xlslice_fifo_write_start_1/Dout] [get_bd_pins Dout8]
connect_bd_net -net xlslice_1_Dout [get_bd_pins xlslice_counter_trigger_16_31/Dout] [get_bd_pins Dout10]
connect_bd_net -net xlslice_2_Dout [get_bd_pins xlslice_count_trigger_clear_0/Dout] [get_bd_pins Dout9]
connect_bd_net [get_bd_pins xlslice_adc_0_7/Dout] [get_bd_pins Dout13]
connect_bd_net [get_bd_pins xlslice_clk_psclk_3/Dout] [get_bd_pins Dout2]
connect_bd_net [get_bd_pins xlslice_clk_psen_4/Dout] [get_bd_pins Dout1]
connect_bd_net [get_bd_pins xlslice_clk_psincdec_5/Dout] [get_bd_pins Dout6]
connect_bd_net [get_bd_pins xlslice_dac_8_15/Dout] [get_bd_pins Dout12]
connect_bd_net [get_bd_pins xlslice_duc_sync_6/Dout] [get_bd_pins Dout]
connect_bd_net [get_bd_pins xlslice_fifo_read_start_2/Dout] [get_bd_pins Dout5]
connect_bd_net -net xlslice_reciever_in_10_Dout [get_bd_pins xlslice_reciever_in_9/Dout] [get_bd_pins Dout11]
connect_bd_net [get_bd_pins xlslice_reciever_out_7/Dout] [get_bd_pins Dout3]
connect_bd_net -net xlslice_reciever_out_8_Dout [get_bd_pins xlslice_ddc_sync_8/Dout] [get_bd_pins Dout7]

current_bd_instance /
connect_bd_intf_net -intf_net axi_dma_0_M_AXIS_MM2S [get_bd_intf_pins dac/axis] [get_bd_intf_pins core/M_AXIS_MM2S]
connect_bd_intf_net [get_bd_intf_pins adc/axis] [get_bd_intf_pins core/S_AXIS_S2MM]
connect_bd_intf_net -intf_net processing_system7_0_DDR [get_bd_intf_ports DDR] [get_bd_intf_pins core/DDR]
connect_bd_intf_net -intf_net processing_system7_0_FIXED_IO [get_bd_intf_ports FIXED_IO] [get_bd_intf_pins core/FIXED_IO]
connect_bd_intf_net [get_bd_intf_pins core/M00_AXI] [get_bd_intf_pins debug_ctrl/S_AXI]
connect_bd_net [get_bd_ports ad] [get_bd_pins adc/ad]
connect_bd_net -net adc_0_ad_out [get_bd_pins adc/ad_out] [get_bd_pins core/din]
connect_bd_net -net adc_0_ad_out_vld [get_bd_pins adc/ad_out_vld] [get_bd_pins core/wr_en]
connect_bd_net [get_bd_pins adc/trigger_out] [get_bd_pins core/In0]
connect_bd_net -net axis_write_to_fifo_0_fifo_write_wd_data [get_bd_pins dac/fifo_write_wd_data] [get_bd_pins core/din1]
connect_bd_net -net axis_write_to_fifo_0_fifo_write_wd_en [get_bd_pins dac/fifo_write_wd_en] [get_bd_pins core/wr_en1]
connect_bd_net -net clk_dynamic_clk_out_200M [get_bd_pins core/clk_out_dynamic] [get_bd_ports clk_da_dynamic] [get_bd_pins adc/io_clock]
connect_bd_net [get_bd_ports clk_pl_50M] [get_bd_pins core/clk_pl_50M]
connect_bd_net -net clk_wiz_0_clk_out1 [get_bd_pins core/clk_out1] \
  [get_bd_ports clk_ad_static] [get_bd_pins adc/clk] [get_bd_pins debug_ctrl/s_axi_aclk] [get_bd_pins dac/clk]
connect_bd_net [get_bd_pins core/almost_empty] [get_bd_pins adc/fifo_read_almost_empty]
connect_bd_net [get_bd_pins core/dout] [get_bd_pins adc/fifo_read_rd_data]
connect_bd_net [get_bd_pins core/empty] [get_bd_pins adc/fifo_read_empty]
connect_bd_net -net dac_0_da_in_vld [get_bd_pins dac/da_in_vld] [get_bd_pins core/rd_en1]
connect_bd_net [get_bd_pins debug_ctrl/Dout1] [get_bd_pins core/psen]
connect_bd_net [get_bd_pins debug_ctrl/Dout2] [get_bd_pins core/psclk]
connect_bd_net [get_bd_pins debug_ctrl/Dout5] [get_bd_pins adc/start]
connect_bd_net [get_bd_pins debug_ctrl/Dout6] [get_bd_pins core/psincdec]
connect_bd_net -net div_1 [get_bd_pins debug_ctrl/Dout13] [get_bd_pins adc/div]
connect_bd_net -net fifo_adc_data_count [get_bd_pins core/data_count] [get_bd_pins adc/count]
connect_bd_net -net fifo_dac_almost_full [get_bd_pins core/almost_full] [get_bd_pins dac/fifo_write_almost_full]
connect_bd_net -net fifo_dac_dout [get_bd_pins core/dout1] [get_bd_pins dac/da_in]
connect_bd_net -net fifo_dac_full [get_bd_pins core/full] [get_bd_pins dac/fifo_write_full]
connect_bd_net -net mux_0_data_out [get_bd_pins dac/da] [get_bd_ports da]
connect_bd_net -net rd_en_1 [get_bd_pins adc/fifo_read_rd_en] [get_bd_pins core/rd_en]
connect_bd_net -net reset_dynamic_peripheral_aresetn [get_bd_pins core/peripheral_aresetn] [get_bd_pins adc/io_resetN]
connect_bd_net -net rst_ps7_0_50M_peripheral_aresetn [get_bd_pins core/peripheral_aresetn1] \
  [get_bd_pins adc/resetn] [get_bd_pins debug_ctrl/s_axi_aresetn] [get_bd_pins dac/resetn]
connect_bd_net -net xlslice_0_Dout1 [get_bd_pins debug_ctrl/Dout8] [get_bd_pins dac/start]
connect_bd_net -net xlslice_1_Dout [get_bd_pins debug_ctrl/Dout10] [get_bd_pins adc/target]
connect_bd_net -net xlslice_2_Dout [get_bd_pins debug_ctrl/Dout9] [get_bd_pins adc/clear]
connect_bd_net -net xlslice_dac_8_15_Dout [get_bd_pins debug_ctrl/Dout12] [get_bd_pins dac/div]
connect_bd_net -net xlslice_duc_sync_6_Dout [get_bd_pins debug_ctrl/Dout] [get_bd_pins dac/io_in_sync]
connect_bd_net -net xlslice_reciever_in_10_Dout [get_bd_pins debug_ctrl/Dout11] [get_bd_pins adc/router]
connect_bd_net -net xlslice_reciever_out_7_Dout [get_bd_pins debug_ctrl/Dout3] [get_bd_pins dac/router]
connect_bd_net -net xlslice_reciever_out_8_Dout [get_bd_pins debug_ctrl/Dout7] [get_bd_pins adc/io_in_sync]

# ---- address map ----
assign_bd_address -offset 0x00000000 -range 256M -target_address_space [get_bd_addr_spaces core/axi_dma_0/Data_MM2S] [get_bd_addr_segs core/processing_system7_0/S_AXI_HP0/HP0_DDR_LOWOCM]
assign_bd_address -offset 0x10000000 -range 256M -target_address_space [get_bd_addr_spaces core/axi_dma_0/Data_MM2S] [get_bd_addr_segs core/processing_system7_0/S_AXI_HP1/HP1_DDR_LOWOCM]
assign_bd_address -offset 0x00000000 -range 256M -target_address_space [get_bd_addr_spaces core/axi_dma_0/Data_S2MM] [get_bd_addr_segs core/processing_system7_0/S_AXI_HP0/HP0_DDR_LOWOCM]
assign_bd_address -offset 0x10000000 -range 256M -target_address_space [get_bd_addr_spaces core/axi_dma_0/Data_S2MM] [get_bd_addr_segs core/processing_system7_0/S_AXI_HP1/HP1_DDR_LOWOCM]
assign_bd_address -offset 0x40400000 -range 64K -target_address_space [get_bd_addr_spaces core/processing_system7_0/Data] [get_bd_addr_segs core/axi_dma_0/S_AXI_LITE/Reg]
assign_bd_address -offset 0x41200000 -range 64K -target_address_space [get_bd_addr_spaces core/processing_system7_0/Data] [get_bd_addr_segs debug_ctrl/axi_gpio_0/S_AXI/Reg]

validate_bd_design
save_bd_design
